# Altium schematic sheet LCDTFT_FPC40P_SPI3_3.2INCH_CTP.SchDoc
size A3; SheetNumber: 6; SheetTotal: 7
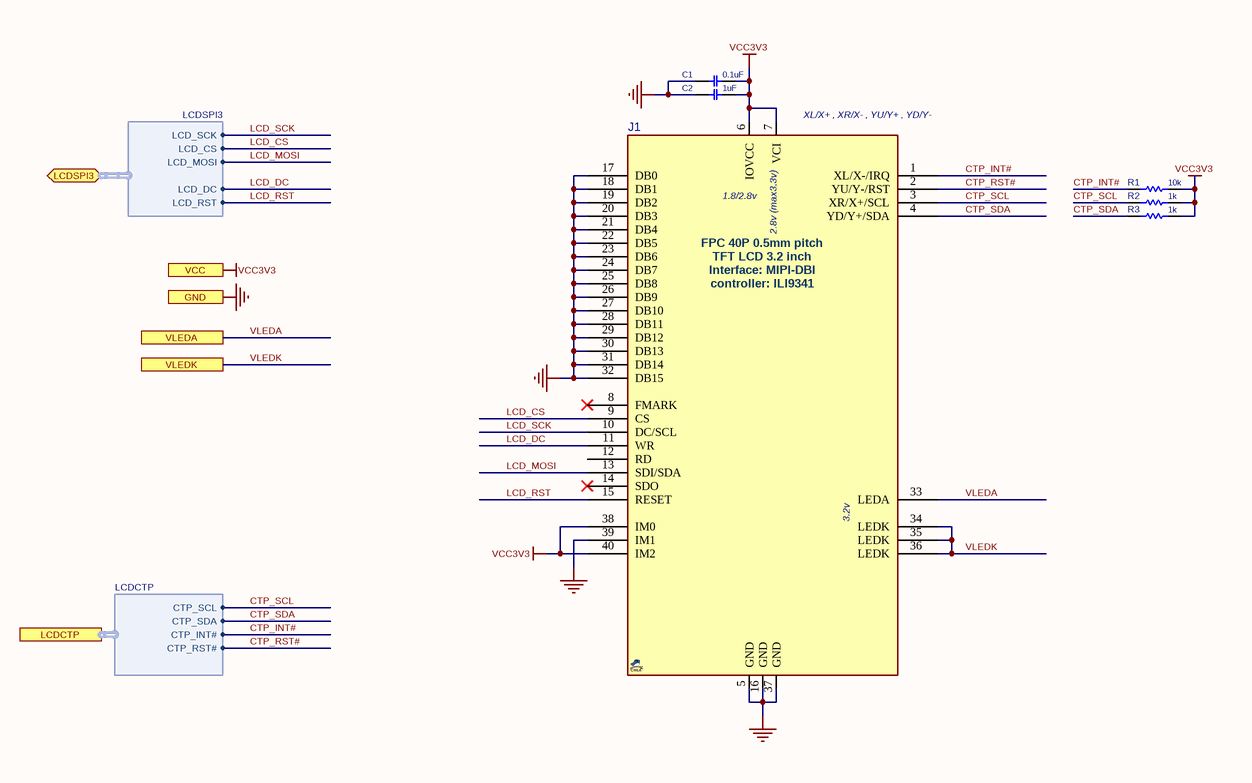
[diagram p0: LCDTFT_FPC40P_SPI3_3.2INCH_CTP.SchDoc]

## Parts
C1  0.1uF  [C0402]
C2  1uF  [C0402]
J1  FPC50_40  [FPC50_40T]  (value not drawn)
R1  10k  [R0402]
R2  1k  [R0402]
R3  1k  [R0402]

## Ports
GND, LCDCTP (harness LCDCTP), LCDSPI3 (bidir, harness LCDSPI3), VCC, VLEDA, VLEDK

## Harnesses
LCDSPI3: LCD_RST, LCD_MOSI, LCD_DC, LCD_SCK, LCD_CS
LCDCTP: CTP_SCL, CTP_SDA, CTP_INT#, CTP_RST#

## Nets
GND: C1.2 C2.2 J1.5(GND) J1.16(GND) J1.17(DB0) J1.18(DB1) J1.19(DB2) J1.20(DB3) J1.21(DB4) J1.22(DB5) J1.23(DB6) J1.24(DB7) J1.25(DB8) J1.26(DB9) J1.27(DB10) J1.28(DB11) J1.29(DB12) J1.30(DB13) J1.31(DB14) J1.32(DB15) J1.37(GND) J1.39(IM1) ; port GND
VCC3V3: C1.1 C2.1 J1.6(IOVCC) J1.7(VCI) J1.38(IM0) J1.40(IM2) R1.2 R2.2 R3.2 ; port VCC
CTP_INT#: J1.1(XL/X-/IRQ) R1.1 ; port LCDCTP.CTP_INT#
CTP_RST#: J1.2(YU/Y-/RST) ; port LCDCTP.CTP_RST#
CTP_SCL: J1.3(XR/X+/SCL) R2.1 ; port LCDCTP.CTP_SCL
CTP_SDA: J1.4(YD/Y+/SDA) R3.1 ; port LCDCTP.CTP_SDA
LCD_CS: J1.9(CS) ; port LCDSPI3.LCD_CS
LCD_DC: J1.11(WR) ; port LCDSPI3.LCD_DC
LCD_MOSI: J1.13(SDI/SDA) ; port LCDSPI3.LCD_MOSI
LCD_RST: J1.15(RESET) ; port LCDSPI3.LCD_RST
LCD_SCK: J1.10(DC/SCL) ; port LCDSPI3.LCD_SCK
VLEDA: J1.33(LEDA) ; port VLEDA
VLEDK: J1.34(LEDK) J1.35(LEDK) J1.36(LEDK) ; port VLEDK

Not connected (* = marked no-connect by the designer): J1 8(FMARK)* 12(RD) 14(SDO)*

## Notes on the sheet
- (near J1) XL/X+ , XR/X- , YU/Y+ , YD/Y-
- (in symbol LCDTFT_DBI_FPC40P_3.2INCH) 1.8/2.8v; 2.8v (max3.3v); FPC 40P 0.5mm pitch; TFT LCD 3.2 inch; Interface: MIPI-DBI; controller: ILI9341; 3.2v

## Library data of the parts
C1 = CAP_SMD_MLCC: CAP, MLCC; PARAM: X7R, 10%, -55~125oC; MANF_P#: GRM155R71H104KE14D; MANF: Murata; PARAM2: 50v; PRICE: 100: 0.018$; ASSEMBLY: ASSEMBLY; VALUE: 0.1uF
C2 = CAP_SMD_MLCC: CAP, MLCC; PARAM: X5R, 10%; PRICE: 50,000:	$0.006; MANF_P#: -; MANF: -; PARAM2: -; ASSEMBLY: ASSEMBLY; VALUE: 1uF
J1 = LCDTFT_DBI_FPC40P_3.2INCH: LCD TFT Color, FPC40P, 3.2" with touch; MANF: Hirose; MANF_P#: FH12A-40S-0.5SH; VALUE: FPC50_40
R1-R3 = RES_SMD: RESISTOR, SMD; PARAM: 0.063W; DESC: DESCRIPTION; DIST#: MOUSER; PARAM2: 1%; MANF_P#: -; MANF: -; ASSEMBLY: ASSEMBLY; PRICE: 100= 0.3$
  R1: VALUE: 10k
  R2 R3: VALUE: 1k